# EAGLE schematic Schematic (EAGLE 9.7.0)
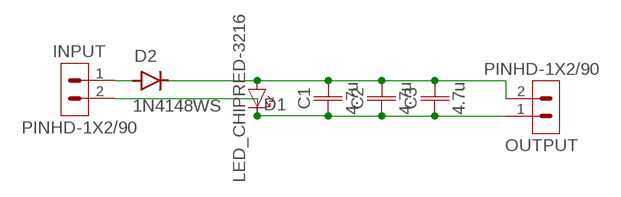
[diagram p0: schematic, sheet 1]

## Parts
C1  4.7u  C_CHIP-1210(3225-METRIC)  [CAPC3225X135]
C2  4.7u  C_CHIP-1210(3225-METRIC)  [CAPC3225X135]
C3  4.7u  C_CHIP-1210(3225-METRIC)  [CAPC3225X135]
D1  LED_CHIPRED-3216  [LEDC3216X110N_R]
D2  1N4148WS  [SOD-323]
INPUT  PINHD-1X2/90  [1X02/90]
OUTPUT  PINHD-1X2/90  [1X02/90]

## Nets
N$1: D2.A INPUT.1
N$2: C1.2 C2.2 C3.2 D1.2(A) D2.C OUTPUT.2
N$3: C1.1 C2.1 C3.1 D1.1(C) INPUT.2 OUTPUT.1

## Library data of the parts
C1-C3 = Capacitor:C: Capacitor - Generic; CATEGORY: Capacitor; PACKAGE_SIZE: 1210; PACKAGE_TYPE: Surface Mount; SUBCATEGORY: Ceramic Capacitors; TYPE: MLCC
D1 = Opto-Electronic:LED_CHIP: LED - Generic; CATEGORY: Optoelectronics; COLOR: Red; DESCRIPTION: Chip LED Red 3216 (METRIC) Package 3.20 X 1.60 X 1.10 mm body; PACKAGE_SIZE: 3216 (METRIC); PACKAGE_TYPE: Surface Mount; SUBCATEGORY: LED; TYPE: Chip
D2 = Diodes:1N4148WS: DIODE GEN PURP 75V 150MA SOD323F Manufacturer's datasheet <https://www.onsemi.com/pub/Collateral/1N914BWS-D.pdf>; CREATED_BY: PCBLayout.com; DIGIKEY_PART_NUMBER: 1N4148WSFSTR-ND; MANUFACTURER: Diodes Incorporated; MPN: 1N4148WS; PACKAGE: SOD-323
INPUT OUTPUT = Connector:PINHD-1X2: Pin Header; CATEGORY: Connectors; DESCRIPTION: Header-Right Angle-2 Position; PACKAGE_TYPE: Through Hole; PITCH: 0.100" (2.54mm); SUBCATEGORY: Headers; TYPE: Male Pins